# Altium schematic sheet root.SchDoc
size A4; SheetNumber: 1; SheetTotal: 9
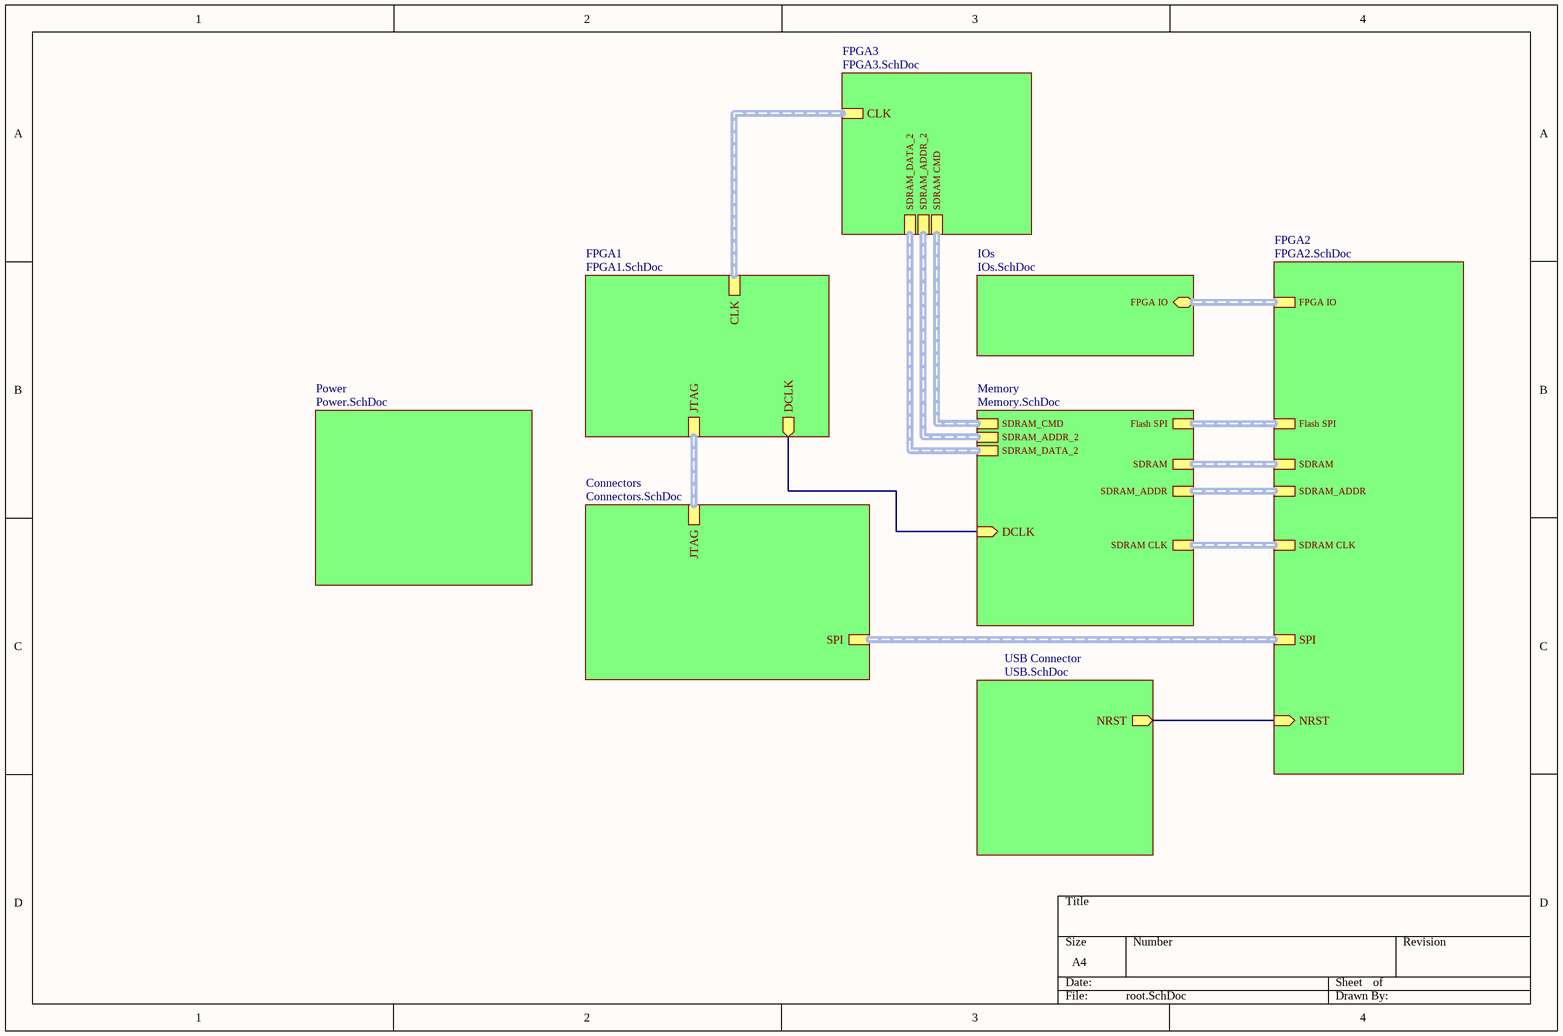
[diagram p0: root.SchDoc]

## Sub-sheets
Connectors = Connectors.SchDoc: JTAG, SPI
FPGA1 = FPGA1.SchDoc: CLK, JTAG, DCLK (out)
FPGA2 = FPGA2.SchDoc: FPGA IO, Flash SPI, SDRAM, SDRAM_ADDR, SDRAM CLK, SPI, NRST (in)
FPGA3 = FPGA3.SchDoc: CLK, SDRAM CMD, SDRAM_ADDR_2, SDRAM_DATA_2
IOs = IOs.SchDoc: FPGA IO (bidir)
Memory = Memory.SchDoc: Flash SPI, SDRAM, SDRAM_ADDR, SDRAM_CMD, SDRAM CLK, DCLK (in), SDRAM_ADDR_2, SDRAM_DATA_2
Power = Power.SchDoc: no entries
USB Connector = USB.SchDoc: NRST (out)

## Nets
(unnamed): sheet FPGA1/DCLK, sheet Memory/DCLK
(unnamed): sheet USB Connector/NRST, sheet FPGA2/NRST

## Buses and harness runs
harness sheet Connectors/JTAG = sheet FPGA1/JTAG
harness sheet Connectors/SPI = sheet FPGA2/SPI
harness sheet FPGA1/CLK = sheet FPGA3/CLK
harness sheet FPGA2/Flash SPI = sheet Memory/Flash SPI
harness sheet FPGA2/FPGA IO = sheet IOs/FPGA IO
harness sheet FPGA2/SDRAM = sheet Memory/SDRAM
harness sheet FPGA2/SDRAM CLK = sheet Memory/SDRAM CLK
harness sheet FPGA2/SDRAM_ADDR = sheet Memory/SDRAM_ADDR
harness sheet FPGA3/SDRAM CMD = sheet Memory/SDRAM_CMD
harness sheet FPGA3/SDRAM_ADDR_2 = sheet Memory/SDRAM_ADDR_2
harness sheet FPGA3/SDRAM_DATA_2 = sheet Memory/SDRAM_DATA_2